# EAGLE schematic Pottery Door TinkerAccess (EAGLE 9.6.2)

## Sheet 1 of 3
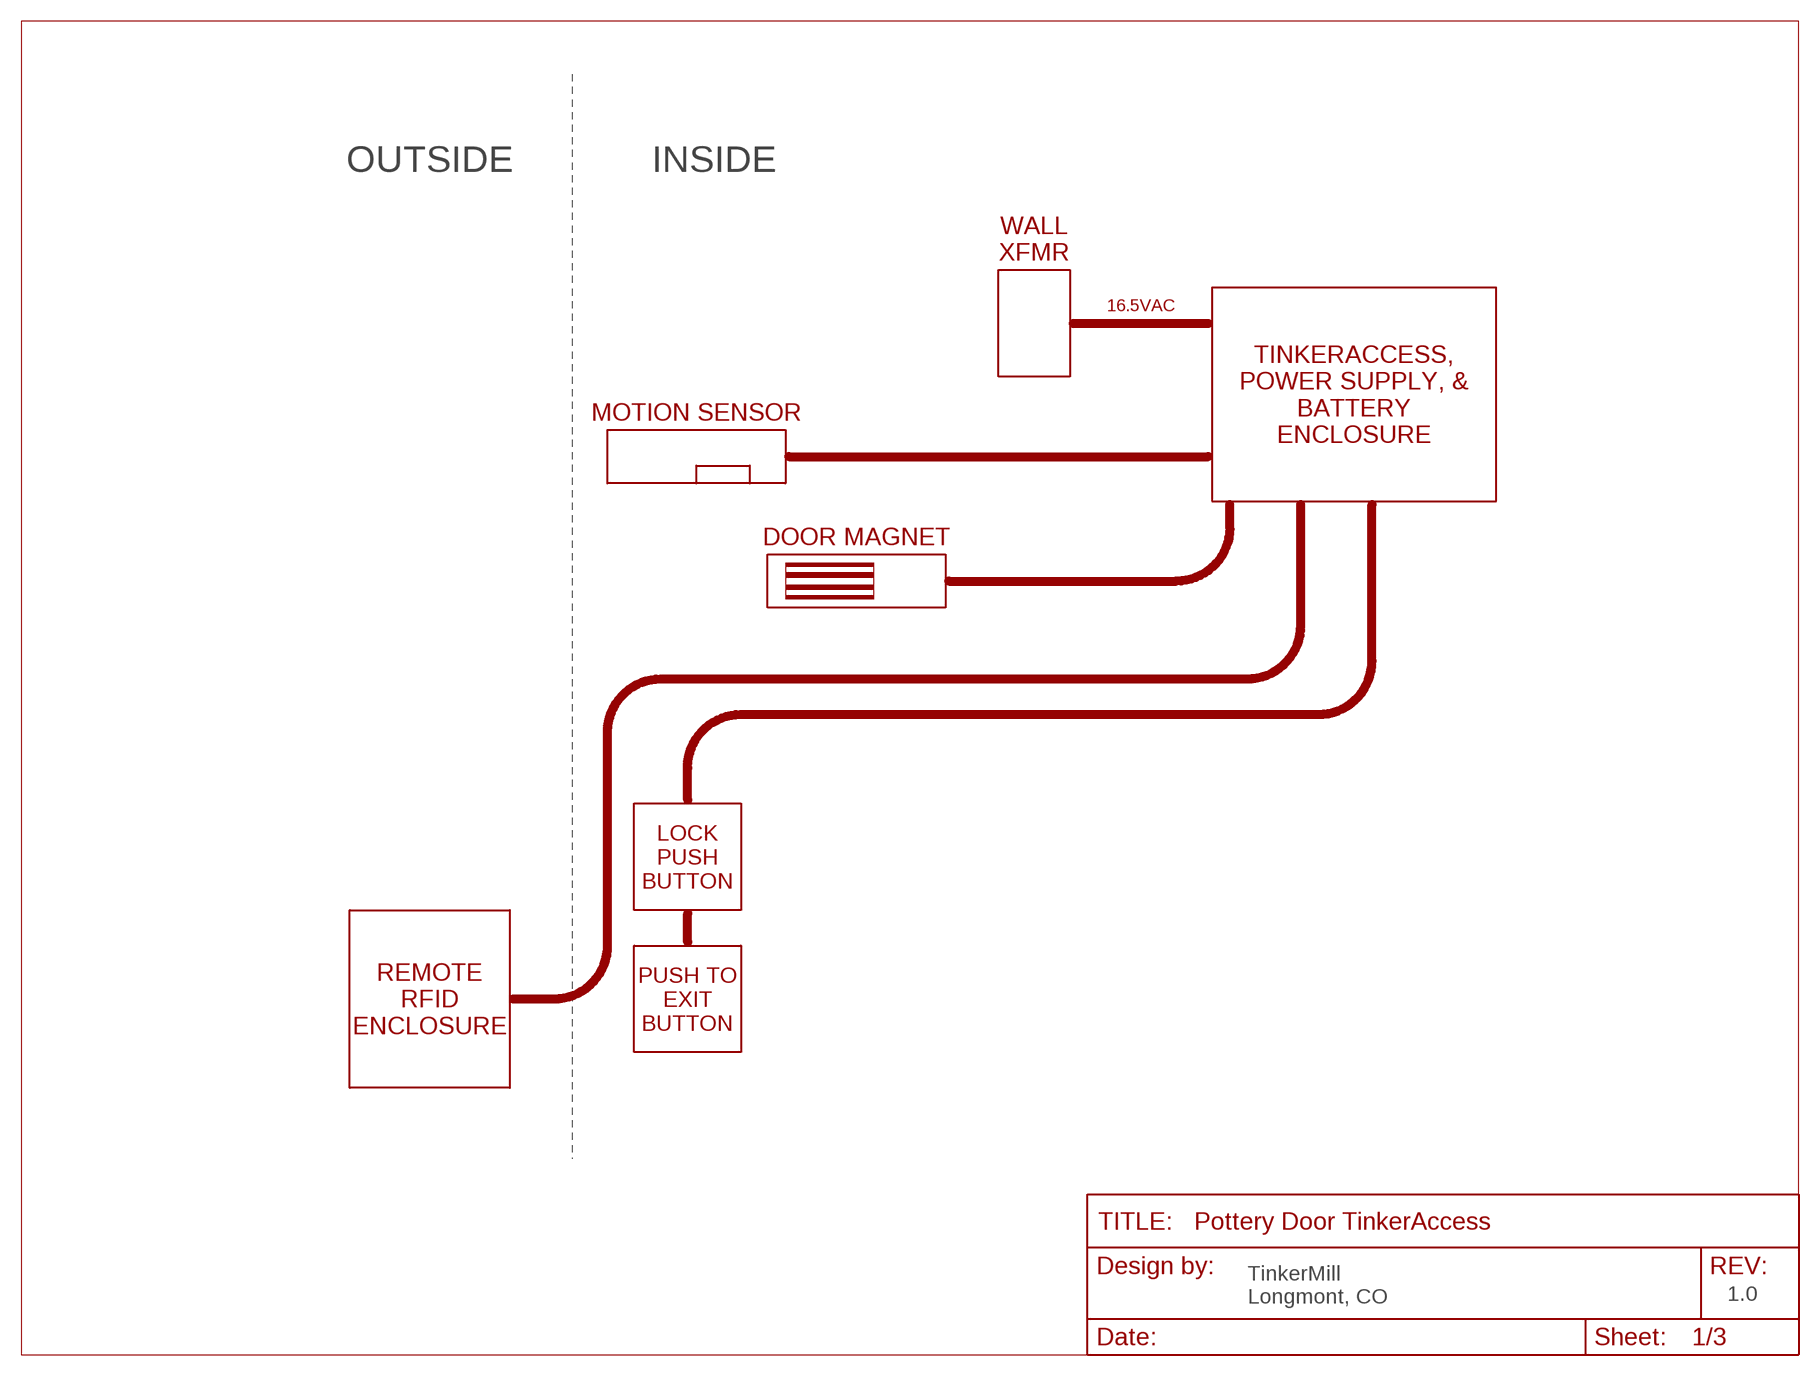
[diagram p0: schematic, sheet 1]

### Notes on the sheet
- OUTSIDE | INSIDE
- WALL
  XFMR
- 16.5VAC
- TINKERACCESS,
  POWER SUPPLY, &
  BATTERY
  ENCLOSURE
- MOTION SENSOR
- DOOR MAGNET
- LOCK
  PUSH
  BUTTON
- REMOTE
  RFID
  ENCLOSURE
- PUSH TO
  EXIT
  BUTTON
- TinkerMill
  Longmont, CO
- 1.0

## Sheet 2 of 3
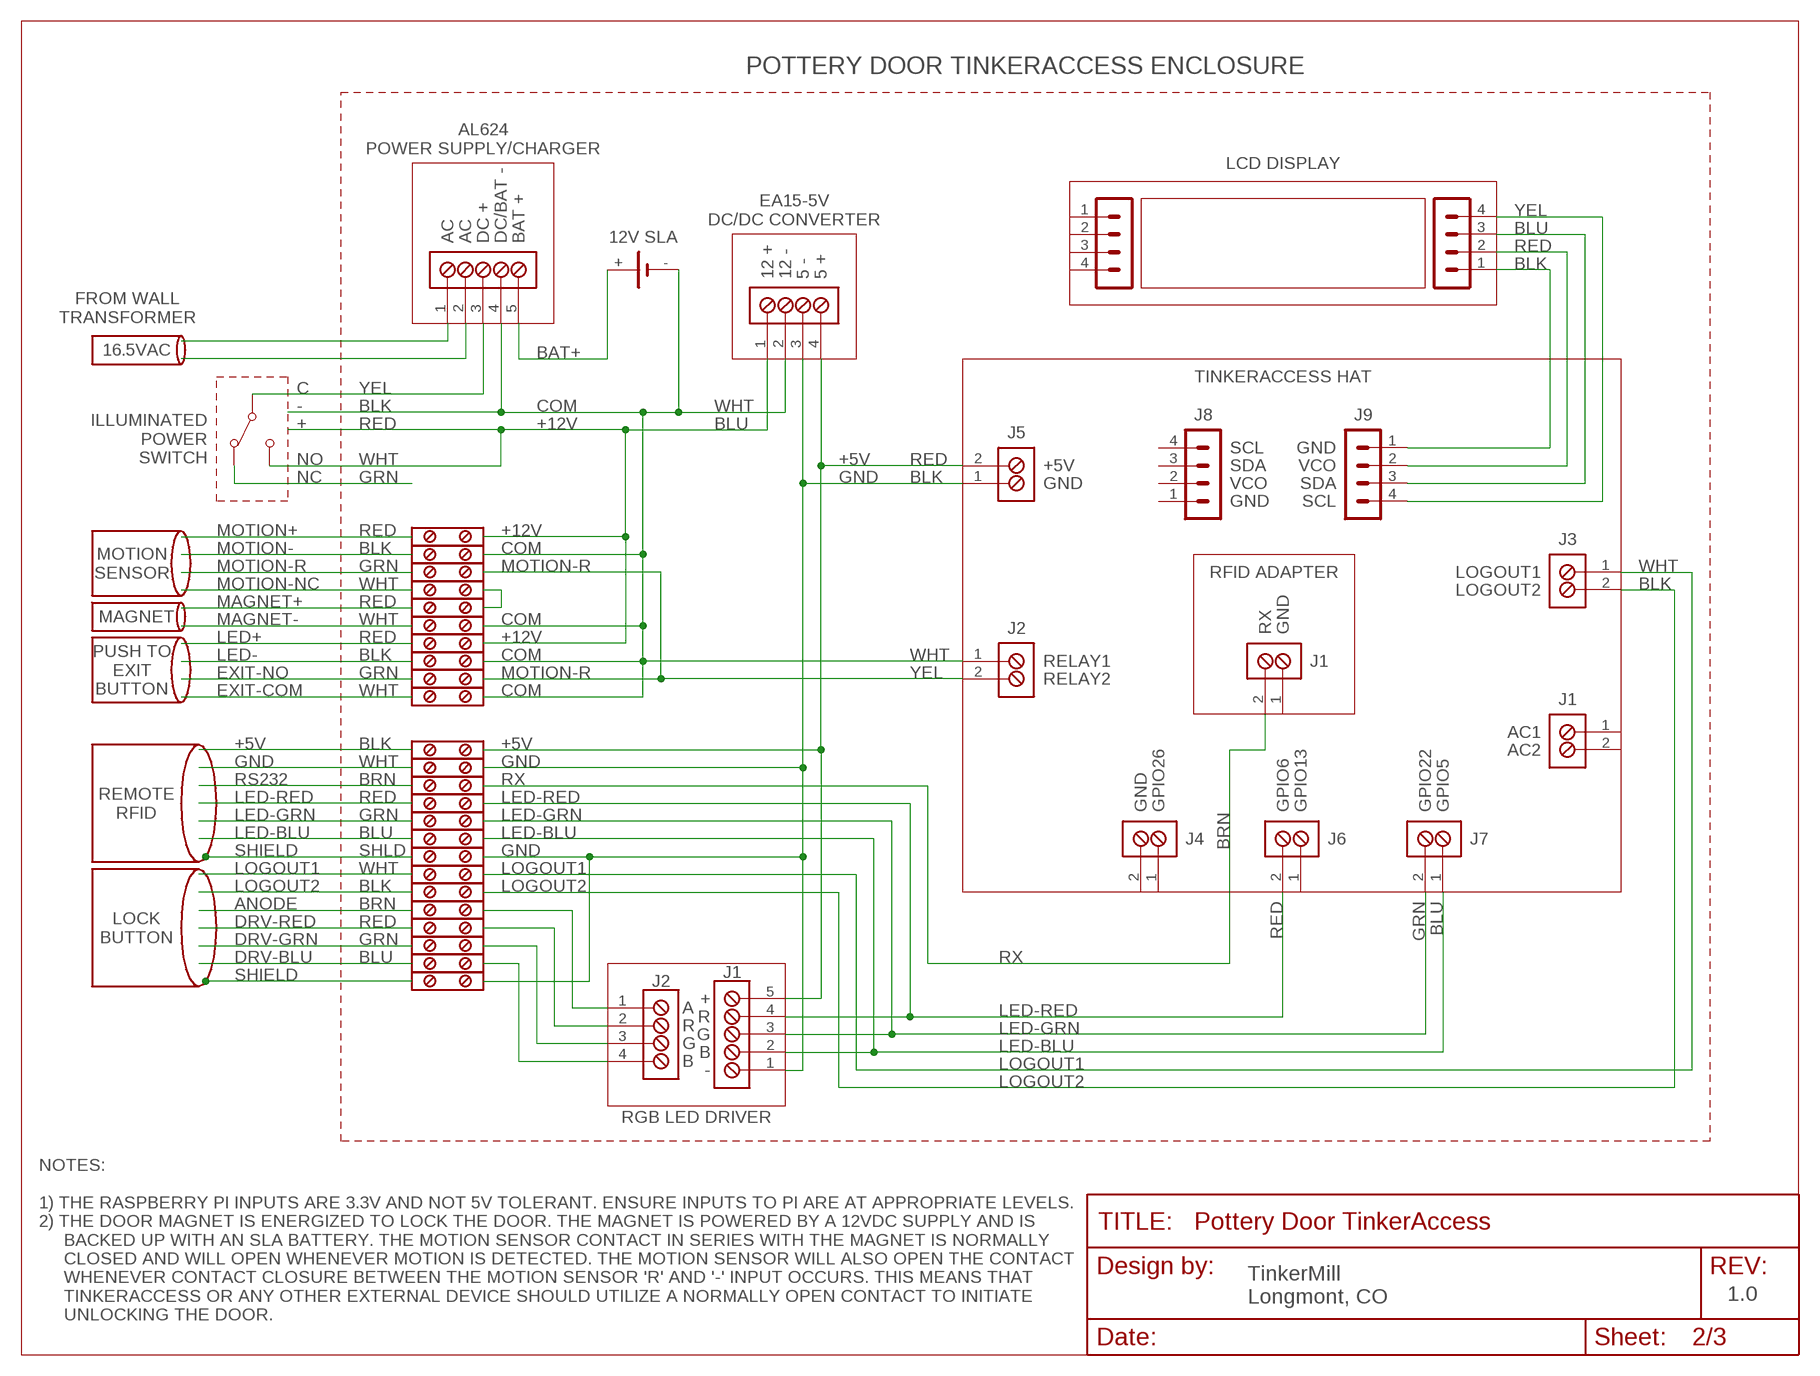
[diagram p1: schematic, sheet 2]

### Parts
BT1  12V SLA  BATTERY_1043P  [BATTERY_HOLDER_1043P]
J1  TB_2X1_TE_CONN_ED555_2DS  [TE_CONN_ED555_2DS]
J2  TB_2X1_TE_CONN_ED555_2DS  [TE_CONN_ED555_2DS]
J3  TB_2X1_TE_CONN_ED555_2DS  [TE_CONN_ED555_2DS]
J4  TB_2X1_TE_CONN_ED555_2DS  [TE_CONN_ED555_2DS]
J5  TB_2X1_TE_CONN_ED555_2DS  [TE_CONN_ED555_2DS]
J6  TB_2X1_TE_CONN_ED555_2DS  [TE_CONN_ED555_2DS]
J7  TB_2X1_TE_CONN_ED555_2DS  [TE_CONN_ED555_2DS]
J8  HDR_4X1_2.54MM_LOCKING_RA  [HDR_4X1_2.54MM_LOCKING_RA]
J9  HDR_4X1_2.54MM_LOCKING_RA  [HDR_4X1_2.54MM_LOCKING_RA]
J10  HDR_4X1_2.54MM_LOCKING_RA  [HDR_4X1_2.54MM_LOCKING_RA]
J11  HDR_4X1_2.54MM_LOCKING_RA  [HDR_4X1_2.54MM_LOCKING_RA]
J12  J1  TB_2X1_TE_CONN_ED555_2DS  [TE_CONN_ED555_2DS]
J14  J2  TB_4X1_ON_SHORE_OSTVN04A150  [ON_SHORE_OSTVN04A150]
J15  J1  TB_5X1_ON_SHORE_OSTVN05A150  [ON_SHORE_OSTVN05A150]
J16  TB_5X1_TE_CONN_ED555_5DS  [TE_CONN_ED555_5DS]
J17  TB_4X1_TE_CONN_ED555_4DS  [TE_CONN_ED555_4DS]
SW1  TOGGLE_SWITCH_SPDT  (no package)
TB1  TERMINAL_BLOCK  (no package)
TB2  TERMINAL_BLOCK  (no package)
TB3  TERMINAL_BLOCK  (no package)
TB4  TERMINAL_BLOCK  (no package)
TB5  TERMINAL_BLOCK  (no package)
TB6  TERMINAL_BLOCK  (no package)
TB7  TERMINAL_BLOCK  (no package)
TB8  TERMINAL_BLOCK  (no package)
TB9  TERMINAL_BLOCK  (no package)
TB10  TERMINAL_BLOCK  (no package)
TB11  TERMINAL_BLOCK  (no package)
TB12  TERMINAL_BLOCK  (no package)
TB13  TERMINAL_BLOCK  (no package)
TB14  TERMINAL_BLOCK  (no package)
TB15  TERMINAL_BLOCK  (no package)
TB16  TERMINAL_BLOCK  (no package)
TB17  TERMINAL_BLOCK  (no package)
TB18  TERMINAL_BLOCK  (no package)
TB19  TERMINAL_BLOCK  (no package)
TB20  TERMINAL_BLOCK  (no package)
TB21  TERMINAL_BLOCK  (no package)
TB22  TERMINAL_BLOCK  (no package)
TB23  TERMINAL_BLOCK  (no package)
TB24  TERMINAL_BLOCK  (no package)

### Nets
+5V: J5.2 J15.5 J17.4 TB1.B
+12V: J17.1 SW1.NO TB12.B TB17.B
BAT+: BT1.+ J16.5
COM: BT1.- J2.1 J16.4 J17.2 TB10.B TB14.B TB18.B TB24.B
EXIT-BLK: TB10.A ; also sheet 3
EXIT-GRN: TB4.A ; also sheet 3
EXIT-RED: TB12.A ; also sheet 3
EXIT-WHT: TB24.A ; also sheet 3
GND: J5.1 J15.1 J17.3 TB2.B TB11.B TB23.B
LCD-GND: J9.1 J11.1
LCD-SCL: J9.4 J11.4
LCD-SDA: J9.3 J11.3
LCD-VCO: J9.2 J11.2
LED-BLU: J7.1 J15.2 TB7.B
LED-GRN: J7.2 J15.3 TB6.B
LED-RED: J6.2 J15.4 TB5.B
LOCK-BLK: TB8.A ; also sheet 3
LOCK-BLU: TB22.A ; also sheet 3
LOCK-BRN: TB15.A ; also sheet 3
LOCK-GRN: TB21.A ; also sheet 3
LOCK-RED: TB16.A ; also sheet 3
LOCK-SHLD: TB23.A
LOCK-WHT: TB9.A ; also sheet 3
LOGOUT1: J3.1 TB9.B ; also sheet 3
LOGOUT2: J3.2 TB8.B ; also sheet 3
MAGNET-RED: TB13.A ; also sheet 3
MAGNET-WHT: TB14.A ; also sheet 3
MOTION-BLK: TB18.A ; also sheet 3
MOTION-GRN: TB19.A ; also sheet 3
MOTION-R: J2.2 TB4.B TB19.B
MOTION-RED: TB17.A ; also sheet 3
MOTION-WHT: TB20.A ; also sheet 3
N$1: J16.3 SW1.C
N$2: SW1.NC
N$4: TB13.B TB20.B
N$6: J14.1 TB15.B
N$7: J14.2 TB16.B
N$8: J14.3 TB21.B
N$9: J14.4 TB22.B
REMOTE-BLK: TB1.A ; also sheet 3
REMOTE-BLU: TB7.A ; also sheet 3
REMOTE-BRN: TB3.A ; also sheet 3
REMOTE-GRN: TB6.A ; also sheet 3
REMOTE-RED: TB5.A ; also sheet 3
REMOTE-SHLD: TB11.A
REMOTE-WHT: TB2.A ; also sheet 3
RX: J12.2 TB3.B
XFMR1: J16.1
XMFR2: J16.2
Unconnected: J1.1 J1.2 J4.1 J4.2 J6.1 J8.1 J8.2 J8.3 J8.4 J10.1 J10.2 J10.3 J10.4 J12.1

### Notes on the sheet
- POTTERY DOOR TINKERACCESS ENCLOSURE
- AL624
  POWER SUPPLY/CHARGER
- LCD DISPLAY
- YEL
- EA15-5V
  DC/DC CONVERTER
- BLU
- AC | AC | DC + | DC/BAT - | BAT +
- RED
- BLK
- 12 + | 12 - | 5 - | 5 +
- FROM WALL
  TRANSFORMER
- 16.5VAC
- TINKERACCESS HAT
- C | YEL
- - | BLK | WHT
- + | RED | BLU
- ILLUMINATED
  POWER
  SWITCH
- SCL | GND
- NO | WHT | RED | +5V | SDA | VCO
- NC | GRN | BLK | GND | VCO | SDA
- GND | SCL
- MOTION+ | RED
- MOTION- | BLK
- MOTION
  SENSOR
- MOTION-R | GRN | RFID ADAPTER | LOGOUT1 | WHT
- MOTION-NC | WHT | LOGOUT2 | BLK
- MAGNET+ | RED
- MAGNET
- MAGNET- | WHT
- RX | GND
- LED+ | RED
- LED- | BLK | WHT | RELAY1
- PUSH TO
  EXIT
  BUTTON
- EXIT-NO | GRN | YEL | RELAY2
- EXIT-COM | WHT
- AC1
- +5V | BLK | AC2
- GND | WHT
- RS232 | BRN
- REMOTE
  RFID
- LED-RED | RED
- GND | GPIO26 | BRN | GPIO6 | GPIO13 | GPIO22 | GPIO5
- LED-GRN | GRN
- LED-BLU | BLU
- SHIELD | SHLD
- WHT
- BLK
- RED | GRN | BLU
- ANODE | BRN
- LOCK
  BUTTON
- DRV-RED | RED
- DRV-GRN | GRN
- DRV-BLU | BLU
- SHIELD
- +
- A
- R
- R
- G
- G
- B
- B
- -
- RGB LED DRIVER
- NOTES:
  
  1) THE RASPBERRY PI INPUTS ARE 3.3V AND NOT 5V TOLERANT. ENSURE INPUTS TO PI ARE AT APPROPRIATE LEVELS.
  2) THE DOOR MAGNET IS ENERGIZED TO LOCK THE DOOR. THE MAGNET IS POWERED BY A 12VDC SUPPLY AND IS
       BACKED UP WITH AN SLA BATTERY. THE MOTION SENSOR CONTACT IN SERIES WITH THE MAGNET IS NORMALLY
       CLOSED AND WILL OPEN WHENEVER MOTION IS DETECTED. THE MOTION SENSOR WILL ALSO OPEN THE CONTACT
       WHENEVER CONTACT CLOSURE BETWEEN THE MOTION SENSOR 'R' AND '-' INPUT OCCURS. THIS MEANS THAT
       TINKERACCESS OR ANY OTHER EXTERNAL DEVICE SHOULD UTILIZE A NORMALLY OPEN CONTACT TO INITIATE
       UNLOCKING THE DOOR.
- TinkerMill
  Longmont, CO
- 1.0

## Sheet 3 of 3
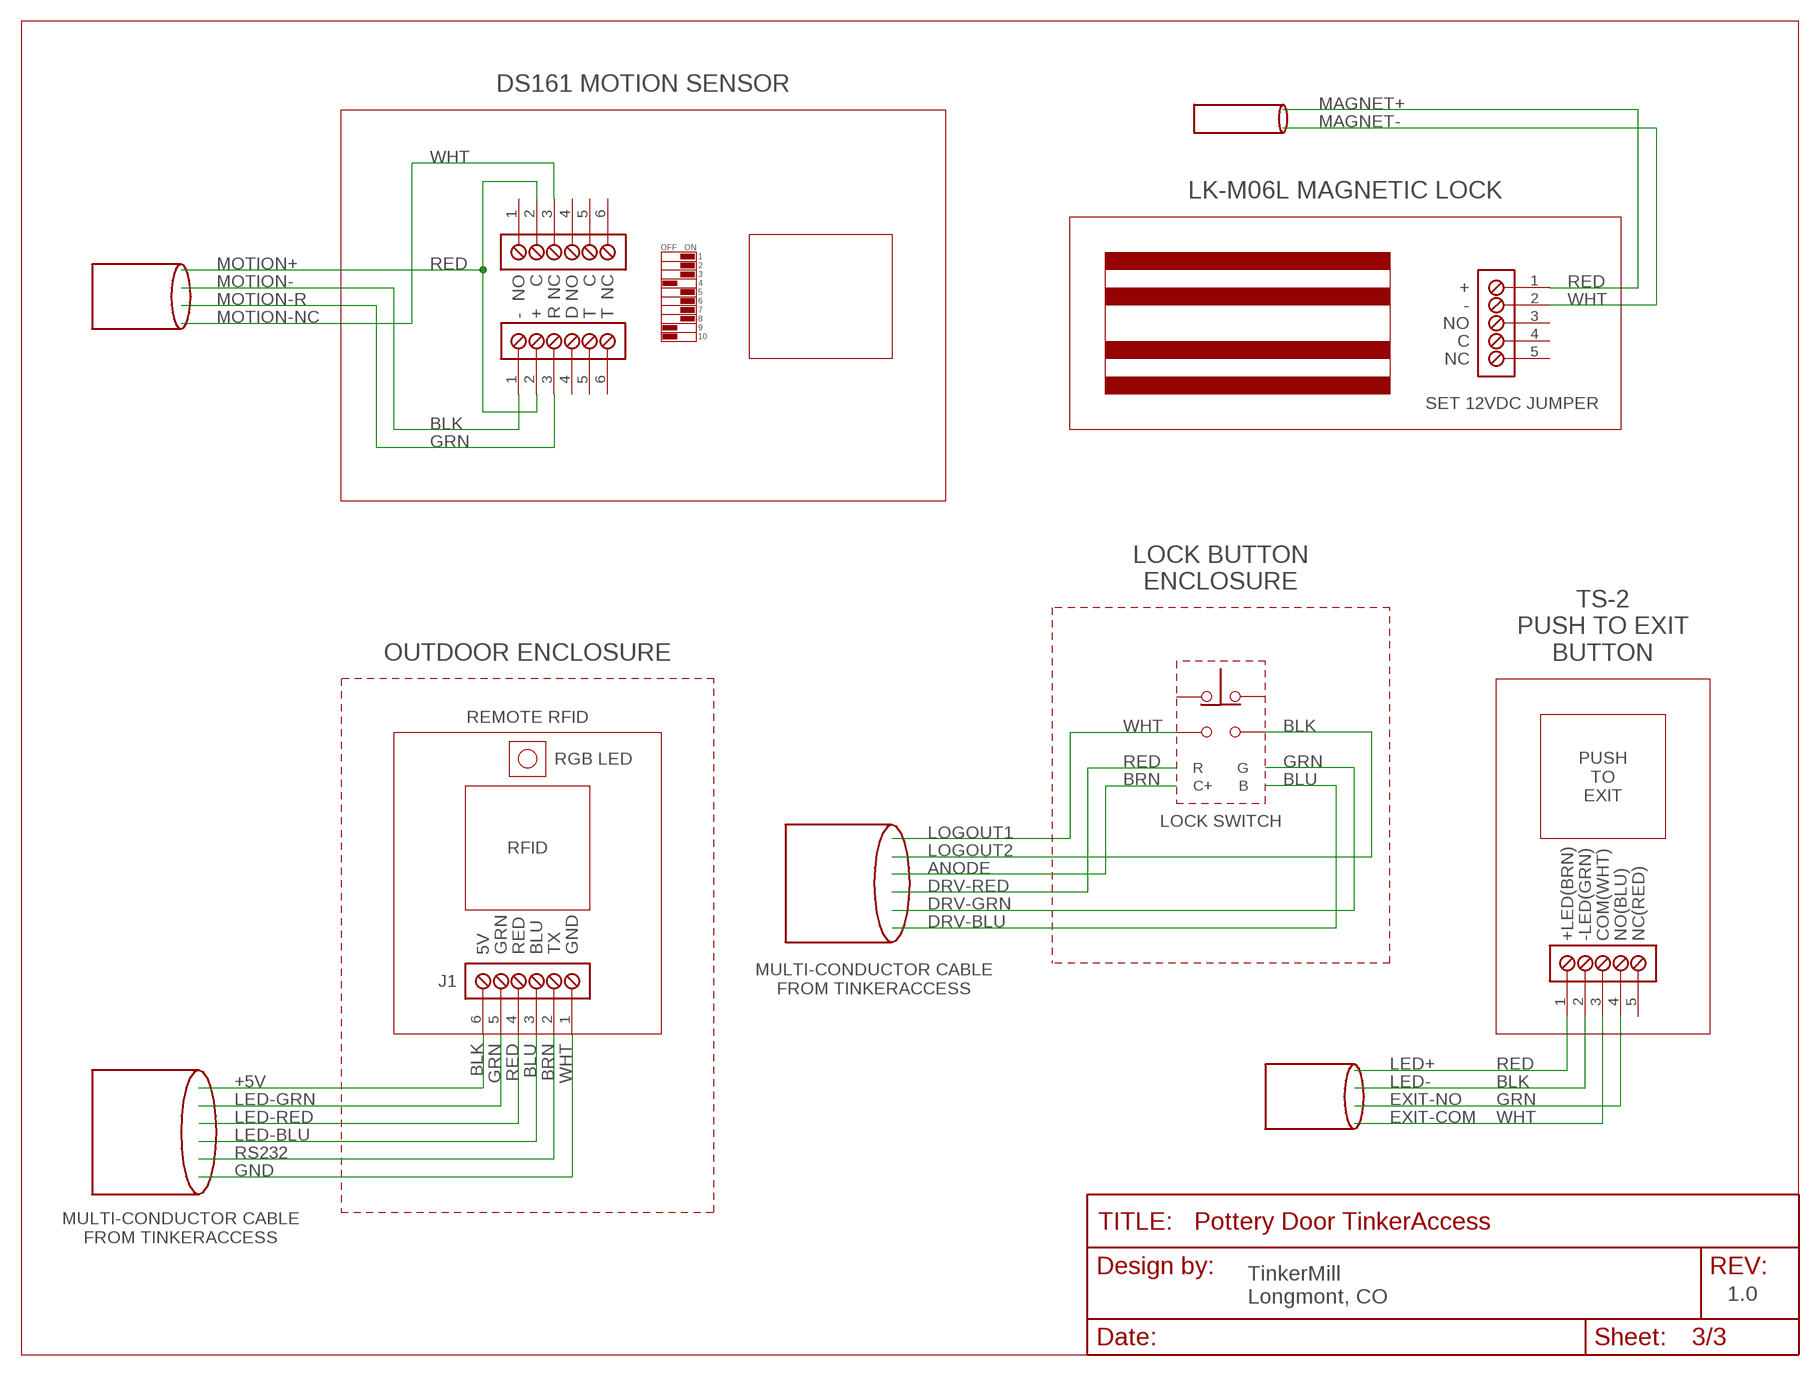
[diagram p2: schematic, sheet 3]

### Parts
J13  J1  TB_6X1_TE_CONN_ED555_6DS  [TE_CONN_ED555_6DS]
J18  TB_6X1_TE_CONN_ED555_6DS  [TE_CONN_ED555_6DS]
J19  TB_6X1_TE_CONN_ED555_6DS  [TE_CONN_ED555_6DS]
J20  TB_5X1_TE_CONN_ED555_5DS  [TE_CONN_ED555_5DS]
J21  TB_5X1_TE_CONN_ED555_5DS  [TE_CONN_ED555_5DS]
SW2  LOCK SWITCH  RGB_SWITCH  (no package)

### Nets
EXIT-BLK: J21.2 ; also sheet 2
EXIT-GRN: J21.4 ; also sheet 2
EXIT-RED: J21.1 ; also sheet 2
EXIT-WHT: J21.3 ; also sheet 2
LOCK-BLK: SW2.4 ; also sheet 2
LOCK-BLU: SW2.B ; also sheet 2
LOCK-BRN: SW2.C+ ; also sheet 2
LOCK-GRN: SW2.G ; also sheet 2
LOCK-RED: SW2.R ; also sheet 2
LOCK-WHT: SW2.3 ; also sheet 2
MAGNET-RED: J20.1 ; also sheet 2
MAGNET-WHT: J20.2 ; also sheet 2
MOTION-BLK: J18.1 ; also sheet 2
MOTION-GRN: J18.3 ; also sheet 2
MOTION-RED: J18.2 J19.2 ; also sheet 2
MOTION-WHT: J19.3 ; also sheet 2
REMOTE-BLK: J13.6 ; also sheet 2
REMOTE-BLU: J13.3 ; also sheet 2
REMOTE-BRN: J13.2 ; also sheet 2
REMOTE-GRN: J13.5 ; also sheet 2
REMOTE-RED: J13.4 ; also sheet 2
REMOTE-WHT: J13.1 ; also sheet 2
Unconnected: J18.4 J18.5 J18.6 J19.1 J19.4 J19.5 J19.6 J20.3 J20.4 J20.5 J21.5 SW2.1 SW2.2

### Notes on the sheet
- DS161 MOTION SENSOR
- MAGNET+
- MAGNET-
- WHT
- LK-M06L MAGNETIC LOCK
- OFF | ON
- 1
- 2
- MOTION+ | RED | NO | C | NC | NO | C | NC
- 3
- 4
- MOTION- | + | RED
- 5
- 6
- MOTION-R | - | WHT
- 7
- MOTION-NC | - | + | R | D | T | T | 8 | NO
- 9
- 10
- C
- NC
- SET 12VDC JUMPER
- BLK
- GRN
- LOCK BUTTON
  ENCLOSURE
- OUTDOOR ENCLOSURE
- TS-2
  PUSH TO EXIT
  BUTTON
- REMOTE RFID
- WHT | BLK
- RGB LED
- RED | GRN
- PUSH
  TO
  EXIT
- BRN | BLU
- RFID
- ANODE
- DRV-RED
- DRV-GRN
- DRV-BLU
- +LED(BRN) | -LED(GRN) | COM(WHT) | NO(BLU) | NC(RED)
- 5V | GRN | RED | BLU | TX | GND
- MULTI-CONDUCTOR CABLE
  FROM TINKERACCESS
- BLK | GRN | RED | BLU | BRN | WHT
- LED+ | RED
- +5V | LED- | BLK
- LED-GRN | EXIT-NO | GRN
- LED-RED | EXIT-COM | WHT
- LED-BLU
- RS232
- GND
- MULTI-CONDUCTOR CABLE
  FROM TINKERACCESS
- TinkerMill
  Longmont, CO
- 1.0

## Library data of the parts
BT1 = TMF_Connectors:BATTERY
J1-J7 J12 = TMF_Connectors:TB_2X1
J8-J11 = TMF_Connectors:HDR_4X1
J13 J18 J19 = TMF_Connectors:TB_6X1
J14 J17 = TMF_Connectors:TB_4X1
J15 J16 J20 J21 = TMF_Connectors:TB_5X1
SW1 = TMF_Schematic_Only:TOGGLE_SWITCH_SPDT
SW2 = TMF_Schematic_Only:RGB_SWITCH
TB1-TB24 = TMF_Schematic_Only:TERMINAL_BLOCK